# EAGLE design PB32Pico_1.x (EAGLE 9.6.2)
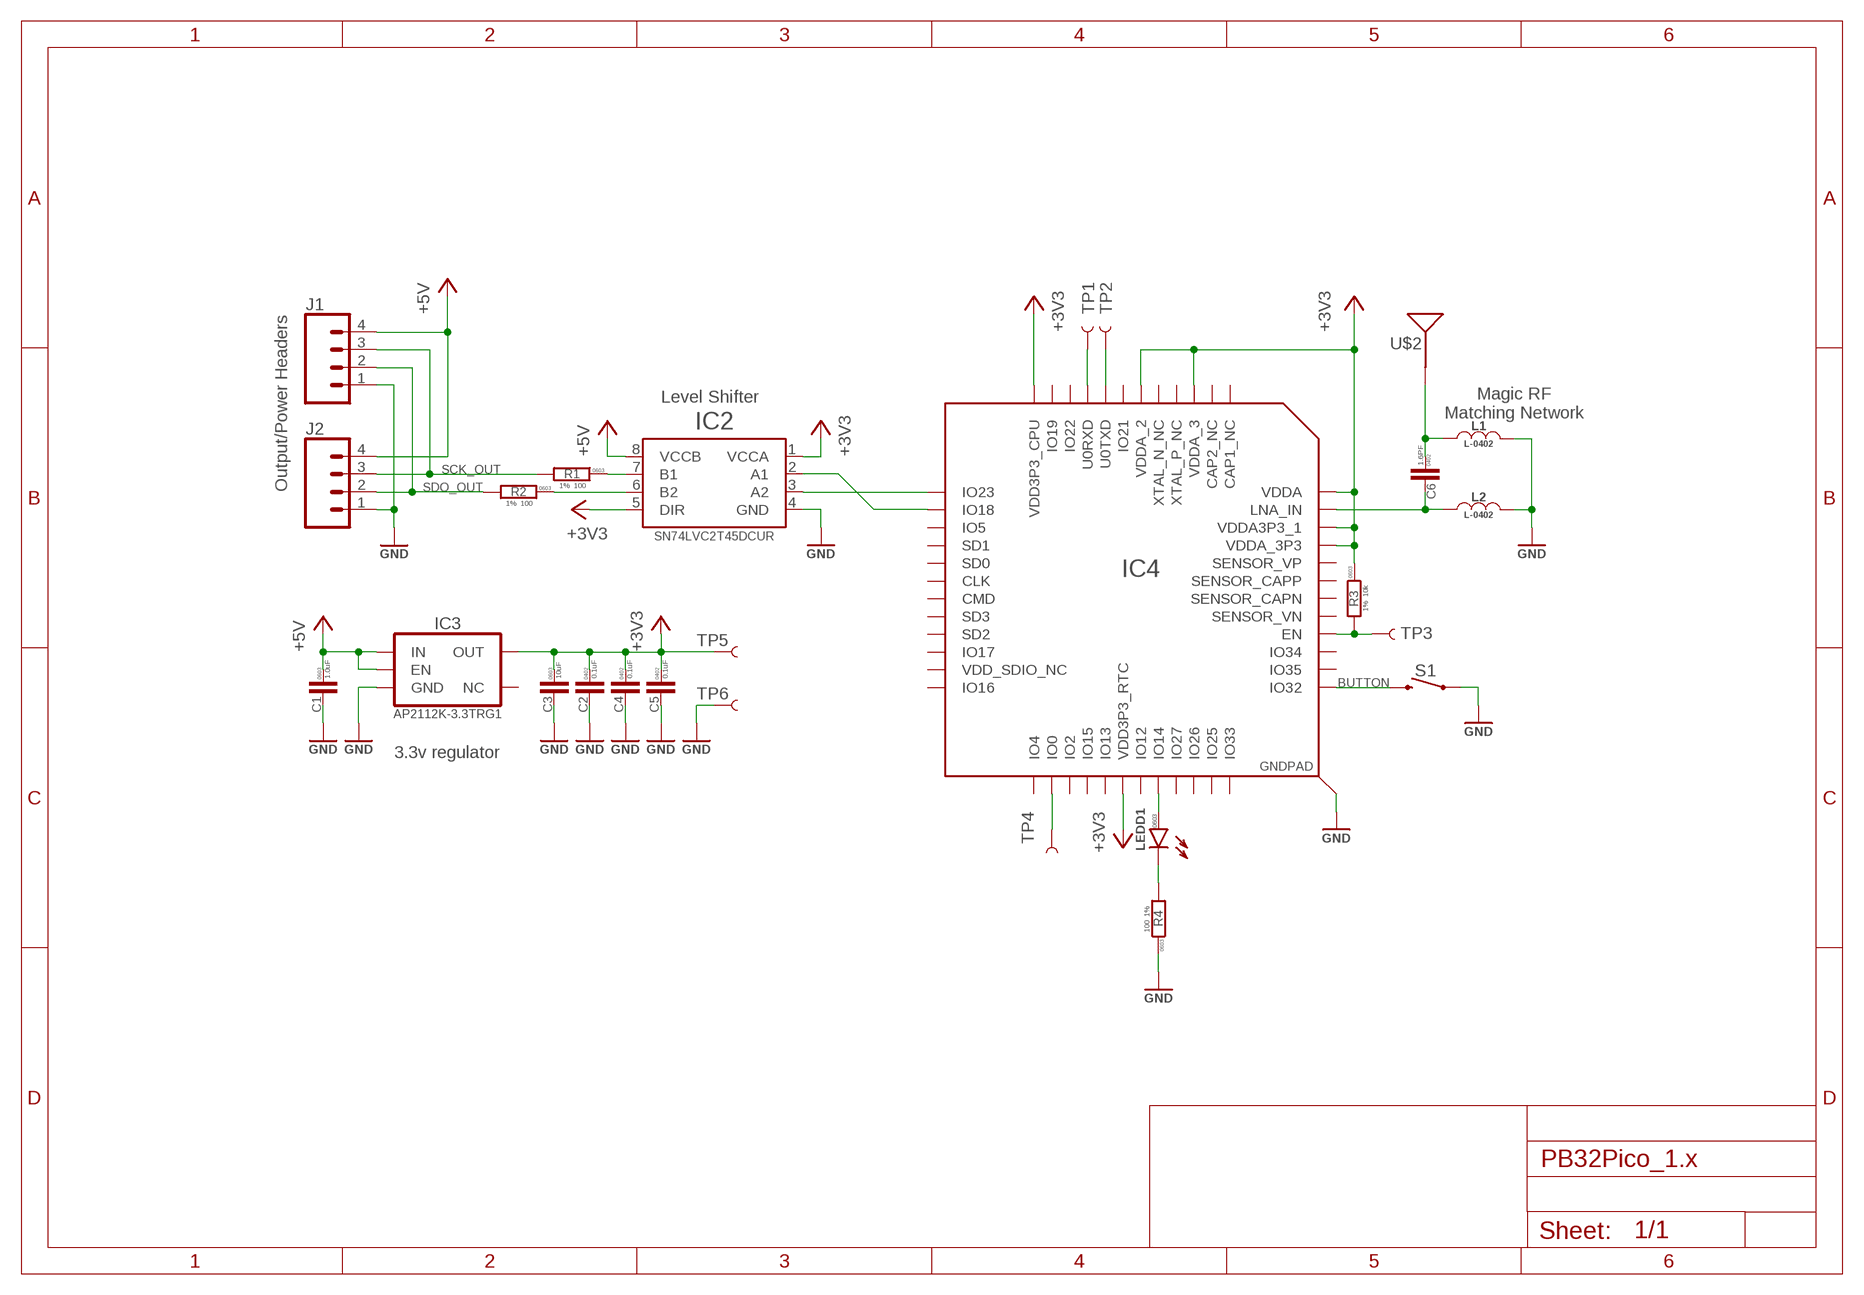
[diagram p0: schematic, sheet 1]

## Parts
C1  1.0uF  C-0603  [C0603]
C2  0.1uF  C-0402  [C0402]
C3  10uF  C-0603  [C0603]
C4  0.1uF  C-0402  [C0402]
C5  0.1uF  C-0402  [C0402]
C6  1.6PF  C-0402  [C0402]
IC2  SN74LVC2T45DCUR  [SOP50P310X90-8N]
IC3  3.3V  V_REG_AP2112K-3.3V  [SOT23-5]
IC4  ESP32-PICO-D4UM-ESP32-PICO-D4  [PICO-D4-QFN48]
J1  CONN_041X04_NO_SILK  [1X04_NO_SILK]
J2  CONN_041X04_NO_SILK  [1X04_NO_SILK]
L1  L-0402  [L0402]
L2  L-0402  [L0402]
LEDD1  LED-0603  [LED0603]
R1  100  R-1%-0603  [R0603]
R2  100  R-1%-0603  [R0603]
R3  10k  R-1%-0603  [R0603]
R4  100  R-1%-0603  [R0603]
S1  MOMENTARY-SWITCH-SPST-SMD-5.2MM  [TACTILE_SWITCH_SMD_5.2MM]
TP1  TEST-POINT3X5  [PAD.03X.05]
TP2  TEST-POINT3X5  [PAD.03X.05]
TP3  TEST-POINT3X5  [PAD.03X.05]
TP4  TEST-POINT3X5  [PAD.03X.05]
TP5  TEST-POINT3X5  [PAD.03X.05]
TP6  TEST-POINT3X5  [PAD.03X.05]
U$2  CHIP-ANTENNASHORT  [CHIPANTENNA-1206-SHORT]

## Nets
+3V3: C2.1 C3.1 C4.1 C5.1 IC2.1(VCCA) IC2.5(DIR) IC3.5(OUT) IC4.1(VDDA) IC4.3(VDDA3P3_1) IC4.4(VDDA_3P3) IC4.19(VDD3P3_RTC) IC4.37(VDD3P3_CPU) IC4.43(VDDA_2) IC4.46(VDDA_3) R3.1 TP5.P$1
+5V: C1.1 IC2.8(VCCB) IC3.1(IN) IC3.3(EN) J1.4 J2.4
BUTTON: IC4.12(IO32) S1.3
EN: IC4.9(EN) R3.2 TP3.P$1
GND: C1.2 C2.2 C3.2 C4.2 C5.2 IC2.4(GND) IC3.2(GND) IC4.EXP(GNDPAD) J1.1 J2.1 L1.2 L2.2 R4.1 S1.1 TP6.P$1
IO0: IC4.23(IO0) TP4.P$1
N$1: C6.1 L1.1 U$2.P$1(SIGNAL)
N$2: IC4.17(IO14) LEDD1.A
N$3: LEDD1.C R4.2
N$4: IC2.7(B1) R1.1
N$5: IC2.6(B2) R2.1
N$6: C6.2 IC4.2(LNA_IN) L2.1
SCK: IC2.2(A1) IC4.35(IO18)
SCK_OUT: J1.3 J2.3 R1.2
SDO: IC2.3(A2) IC4.36(IO23)
SDO_OUT: J1.2 J2.2 R2.2
U0TX: IC4.41(U0TXD) TP2.P$1
UORX: IC4.40(U0RXD) TP1.P$1
Unconnected: IC3.4(NC) IC4.5(SENSOR_VP) IC4.6(SENSOR_CAPP) IC4.8(SENSOR_VN) IC4.10(IO34) IC4.11(IO35) IC4.13(IO33) IC4.14(IO25) IC4.15(IO26) IC4.16(IO27) IC4.20(IO13) IC4.21(IO15) IC4.22(IO2) IC4.24(IO4) IC4.25(IO16) IC4.26(VDD_SDIO_NC) IC4.27(IO17) IC4.28(SD2) IC4.29(SD3) IC4.30(CMD) IC4.31(CLK) IC4.32(SD0) IC4.33(SD1) IC4.34(IO5) IC4.38(IO19) IC4.39(IO22) IC4.44(XTAL_N_NC) IC4.45(XTAL_P_NC) IC4.47(CAP2_NC) IC4.48(CAP1_NC)

## Notes on the sheet
- Level Shifter
- Magic RF
  Matching Network
- Output/Power Headers
- 3.3v regulator

## Power pins joined to a net without a drawn wire
IO12: IC4.18(IO12)
IO21: IC4.42(IO21)
SENSOR_CAPN: IC4.7(SENSOR_CAPN)

## Library data of the parts
C1 C3 = rc:C; PACKAGE: 0603
C2 C4-C6 = rc:C; PACKAGE: 0402
IC2 = pixelblaze:SN74LVC2T45DCUR; MANF#: SN74LVC2T45DCUR
IC3 = pixelblaze:V_REG_AP2112: AP2112 - 600mA CMOS LDO Regulator w/ Enable The AP2112 is CMOS process low dropout linear regulator with enable function, the regulator delivers a guaranteed 600mA (min.) continuous load current. Features Output Voltage Accuracy: ±1.5% Output Current: 600mA (Min.) Foldback Short Current Protection: 50mA Enable Function to Turn ON/OFF VOUT Low Dropout Voltage (3.3V): 250mV (Typ.) @IOUT=600mA Excellent Load Regulation: 0.2%/A (Typ.) Excellent Line Regulation: 0.02%/V (Typ.) Low Quiescent Current: 55μA (Typ.) Low Standby Current: 0.01μA (Typ.) Low Output Noise: 50μVRMS PSRR: 100Hz -65dB, 1kHz -65dB OTSD Protection Stable with 1.0μF Flexible Cap: Ceramic, Tantalum and Aluminum Electrolytic Operation Temperature Range: -40°C to 85°C ESD: MM 400V, HBM 4000V; MANF#: AP2112K-3.3TRG1; PROD_ID: VREG-12457
IC4 = pixelblaze:ESP32-PICO-D4
J1 J2 = SparkFun-Connectors:CONN_04: Multi connection point. Often used as Generic Header-pin footprint for 0.1 inch spaced/style header connections On any of the 0.1 inch spaced packages, you can populate with these: Break Away Headers - Straight <https://www.sparkfun.com/products/116> (PRT-00116) Break Away Male Headers - Right Angle <https://www.sparkfun.com/products/553> (PRT-00553) Female Headers <https://www.sparkfun.com/products/115> (PRT-00115) Break Away Headers - Machine Pin <https://www.sparkfun.com/products/117> (PRT-00117) Break Away Female Headers - Swiss Machine Pin <https://www.sparkfun.com/products/743> (PRT-00743) For SCREWTERMINALS and SPRING TERMINALS visit here: Screw Terimnals on SparkFun.com <https://www.sparkfun.com/search/results?term=Screw+Terminals> (5mm/3.5mm/2.54mm spacing) This device is also useful as a general connection point to wire up your design to another part of your project. Our various solder wires solder well into these plated through hole pads. Hook-Up Wire - Assortment (Stranded, 22 AWG) <https://www.sparkfun.com/products/11375> (PRT-11375) Hook-Up Wire - Assortment (Solid Core, 22 AWG) <https://www.sparkfun.com/products/11367> (PRT-11367) View the entire wire category on our website here <https://www.sparkfun.com/categories/141> Special notes: Molex polarized connector foot print use with SKU : PRT-08231 with associated crimp pins and housings. 1MM SMD Version SKU: PRT-10208; PROD_ID: CONN-09696
L1 L2 = rc:L
LEDD1 = rc:LED: Light emitting diode; PACKAGE: 0603
R1-R4 = rc:R; PACKAGE: 0603; TOLERANCE: 1%
S1 = pixelblaze:MOMENTARY-SWITCH-SPST: Momentary Switch (Pushbutton) - SPST Normally-open (NO) SPST momentary switches (buttons, pushbuttons). Variants PTH-12MM - 12mm square, through-hole Momentary Pushbutton Switch - 12mm Square <https://www.sparkfun.com/products/9190> (COM-09190) PTH-6.0MM, PTH-6.0MM-KIT - 6.0mm square, through-hole Mini Pushbutton Switch <https://www.sparkfun.com/products/97> (COM-00097) KIT package intended for soldering kit's - only one side of pads' copper is exposed. PTH-RIGHT-ANGLE-KIT - Right-angle, through-hole Right Angle Tactile Button <https://www.sparkfun.com/products/10791> - Used on SparkFun BigTime Watch Kit <https://www.sparkfun.com/products/11734> SMD-12MM - 12mm square, surface-mount Tactile Button - SMD (12mm) <https://www.sparkfun.com/products/12993> (COM-12993) Used on SparkFun PicoBoard <https://www.sparkfun.com/products/11888> SMD-4.5MM - 4.5mm Square Trackball Switch Used on SparkFun Blackberry Trackballer Breakout <https://www.sparkfun.com/products/13169> SMD-4.6MMX2.8MM - 4.60mm x 2.80mm, surface mount Used on SparkFun SAMD21 Mini Breakout <https://www.sparkfun.com/products/13664> SMD-5.2MM, SMD-5.2-REDUNDANT - 5.2mm square, surface-mount Mini Pushbutton Switch - SMD <https://www.sparkfun.com/products/8720> (COM-08720) Used on Arduino Pro Mini <https://www.sparkfun.com/products/11114> REDUNDANT package connects both switch circuits together SMD-6.0X3.5MM - 6.0 x 3.5mm, surface mount Momentary Reset Switch SMD <https://www.sparkfun.com/products/8229> (COM-08229) SMD-6.2MM-TALL - 6.2mm square, surface mount Tactile Button - SMD (6mm) <https://www.sparkfun.com/products/12992> Used on SparkFun Digital Sandbox <https://www.sparkfun.com/products/12651> SMD-RIGHT-ANGLE - Right-angle, surface mount Used on SparkFun Block for Intel® Edison - Arduino <https://www.sparkfun.com/products/13036>; PROD_ID: SWCH-08247; SF_SKU: COM-08720
TP1-TP6 = SparkFun-Connectors:TEST-POINT: SparkFun Test Points Bare copper test points for troubleshooting or In-Circuit-Testing. These are used by our Production team for verifying production board runs using pogo-pins on test beds. SparkFun Products: SparkFun LSM9DS1 Breakout <https://www.sparkfun.com/products/13284> SparkFun PSOC <https://www.sparkfun.com/products/13714> SparkFun Load Cell Amplifier <https://www.sparkfun.com/products/13879>
U$2 = pixelblaze:CHIP-ANTENNA

## Board
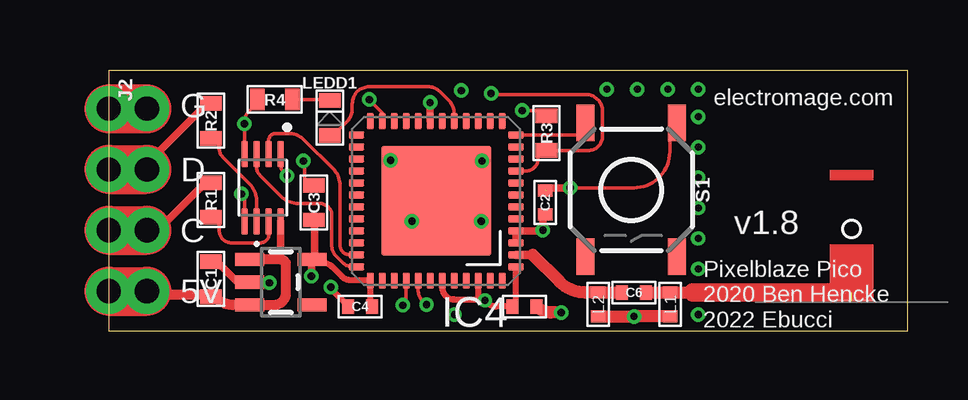
[diagram p1: board, top side]
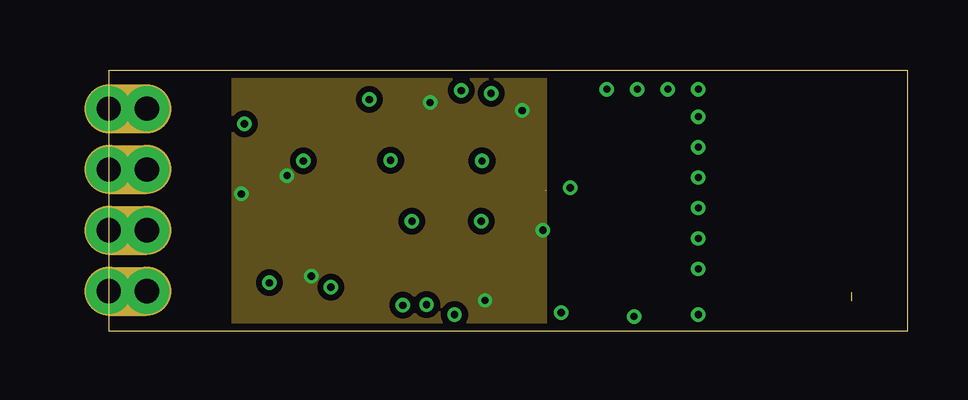
[diagram p2: board, inner layer Route2]
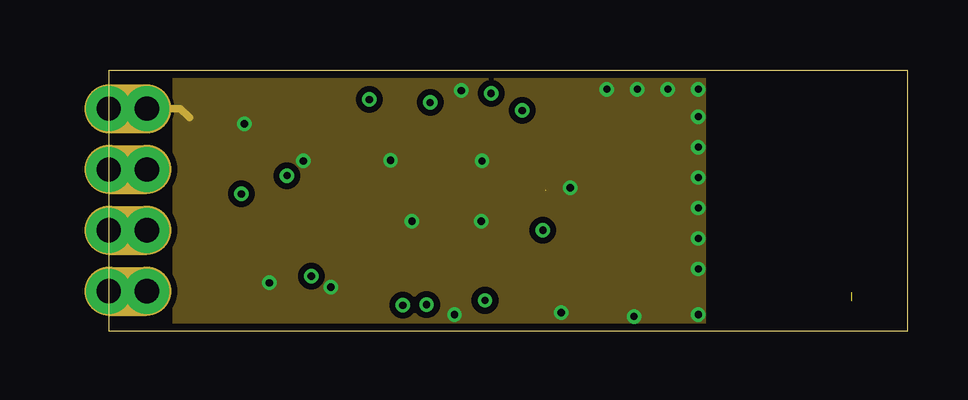
[diagram p3: board, inner layer Route15]
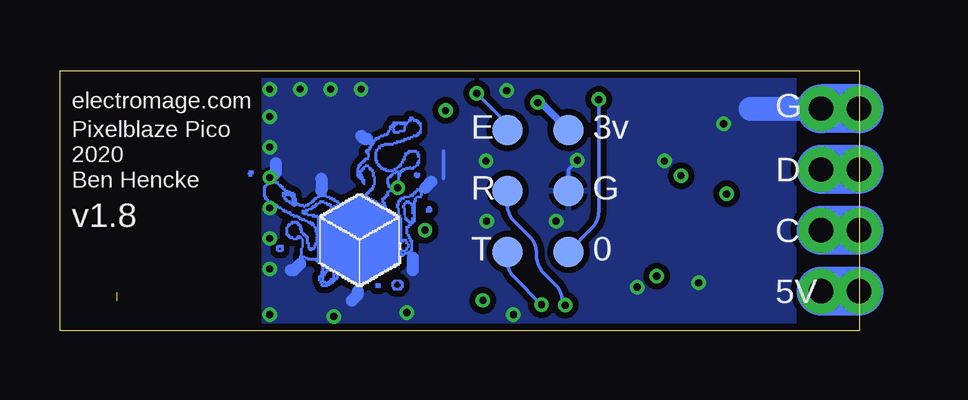
[diagram p4: board, bottom side, seen from below]

Size 33.32 x 10.85 mm. Coordinates in mm from the lower left corner, seen from the top.
Outline: 0,0 33.32,0 33.32,10.85 0,10.85 0,0
Copper layers (1+2*15+16): Top 0.035mm / dielectric 0.12mm / Route2 0.035mm / dielectric 1.2mm / Route15 0.035mm / dielectric 0.12mm / Bottom 0.035mm
Design rules "JLCPCB 4 layer": minimum track width 0.15mm, minimum drill 0.2mm, track to track 0.15mm, track to pad 0.15mm, pad to pad 0.15mm, via to via 0.15mm, smd to smd 0.15mm, copper to edge 0.3mm, drill to drill 0.2mm, minimum pad ring 0.125mm, minimum via ring 0.125mm, stop-mask expansion 1mil, vias tented up to drill 0.31mm, thermal gap 8mil

### Footprints (pad centres in the part's own frame; a part is rotated, then mirrored left to right if it is on the bottom)
C0603 = smd 0.6 x 0.9: 1 -0.725,0; 2 0.725,0
C0402 = smd 0.5 x 0.6: 1 -0.5,0; 2 0.5,0
SOP50P310X90-8N = smd 1.12 x 0.27: 1 -1.405,0.75; 2 -1.405,0.25; 3 -1.405,-0.25; 4 -1.405,-0.75; 5 1.405,-0.75; 6 1.405,-0.25; 7 1.405,0.25; 8 1.405,0.75
SOT23-5 = smd 0.55 x 1.2: 1 -0.95,-1.3; 2 0,-1.3; 3 0.95,-1.3; 4 0.95,1.3; 5 -0.95,1.3
PICO-D4-QFN48 = smd 0.66 x 0.3: 1 -3.327,2.75; 2 -3.327,2.25; 3 -3.327,1.75; 4 -3.327,1.25; 5 -3.327,0.75; 6 -3.327,0.25; 7 -3.327,-0.25; 8 -3.327,-0.75; 9 -3.327,-1.25; 10 -3.327,-1.75; 11 -3.327,-2.25; 12 -3.327,-2.75; 25 3.327,-2.75; 26 3.327,-2.25; 27 3.327,-1.75; 28 3.327,-1.25; 29 3.327,-0.75; 30 3.327,-0.25; 31 3.327,0.25; 32 3.327,0.75; 33 3.327,1.25; 34 3.327,1.75; 35 3.327,2.25; 36 3.327,2.75 | smd 0.3 x 0.66: 13 -2.75,-3.327; 14 -2.25,-3.327; 15 -1.75,-3.327; 16 -1.25,-3.327; 17 -0.75,-3.327; 18 -0.25,-3.327; 19 0.25,-3.327; 20 0.75,-3.327; 21 1.25,-3.327; 22 1.75,-3.327; 23 2.25,-3.327; 24 2.75,-3.327; 37 2.75,3.327; 38 2.25,3.327; 39 1.75,3.327; 40 1.25,3.327; 41 0.75,3.327; 42 0.25,3.327; 43 -0.25,3.327; 44 -0.75,3.327; 45 -1.25,3.327; 46 -1.75,3.327; 47 -2.25,3.327; 48 -2.75,3.327 | smd 4.572 x 4.572: EXP 0,0
1X04_NO_SILK = drill 1.016 pad 1.88: 1 0,0; 2 2.54,0; 3 5.08,0; 4 7.62,0
L0402 = smd 0.5 x 0.6: 1 -0.5,0; 2 0.5,0
LED0603 = smd 0.6 x 0.9: A 0.725,0; C -0.725,0
R0603 = smd 0.6 x 0.9: 1 -0.725,0; 2 0.725,0
TACTILE_SWITCH_SMD_5.2MM = smd 1.524 x 0.762: 1 -2.794,1.905; 2 2.794,1.905; 3 -2.794,-1.905; 4 2.794,-1.905
PAD.03X.05 = smd 1.27 x 1.27: P$1 0,0
CHIPANTENNA-1206-SHORT = smd 0.1 x 1.8: P$1 -3.7,0

### Placement (x,y rotation side)
C1  4.26,2.16 90 top
C2  18.2,5.35 90 top
C3  8.55,5.35 90 top
C4  10.48,1.02 180 top
C5  17.34,1.02 0 top
C6  21.9,1.6 180 top
IC2  6.42,5.97 270 top
IC3  7.18,2.03 270 top
IC4  13.65,5.42 180 top
J1  1.59,9.27 270 top
J2  0,9.27 270 top
L1  23.4,1.1 270 top
L2  20.4,1.1 270 top
LEDD1  9.21,8.89 270 top
R1  4.26,5.46 90 top
R2  4.26,8.76 90 top
R3  18.25,8.25 270 top
R4  6.92,9.65 0 top
S1  21.78,5.88 270 top
TP1  14.67,5.84 0 bottom
TP2  14.67,3.3 0 bottom
TP3  14.67,8.38 0 bottom
TP4  12.13,3.3 0 bottom
TP5  12.13,8.38 0 bottom
TP6  12.13,5.84 0 bottom
U$2  30.96,4.95 90 top
U$3  [ELECTRO_MAGE_PCB4_PIXEL_2#PNG]  21.66,5.33 0 bottom

### Tracks (layer width: path | path; a pad name or v marks a point on that pad's centre or on a via)
+3V3  (via drill 0.3 pad 0.6)
  Top 0.152: IC2.5 5.67,5.38 arc45 v5.53,5.71 | IC2.1 7.17,6.95 arc45 7.31,6.6 v7.43,6.48 | R3.1 18.03,9.19 v17.24,9.19
  Top 0.25: IC4.43 13.9,1.81 arc90 14.4,1.31 15.4,1.31 | 15.4,1.31 15.64,1.31 v15.69,1.27 15.79,1.16 arc45 16.15,1.02 C5.1 | IC4.46 15.4,1.32 15.4,1.31
  Top 0.254: C4.1 10.9,1.17 IC4.37 10.88,2.12 10.07,2.12 arc-45 9.72,2.27 9.3,2.69 arc45 8.95,2.83 8.63,2.83 IC3.5 | 16.76,1.16 16.84,1.09 C5.1 16.95,1.02 16.95,2.64 IC4.1
  Top 0.305: C3.1 8.58,4.6 8.58,2.98 IC3.5 8.45,2.95 v8.45,2.29 | IC4.3 IC4.4 18.1,4.17 v18.1,4.2 18.1,4.75 C2.1 | IC4.19 v13.4,9.52 v13.4,9.53
  Bottom 0.305: TP5.P$1 13.27,9.53 v13.4,9.53
  pour Route2 (isolate 0.254): 5.2,10.79 18.2,10.79 18.2,0 5.2,0
+5V
  Top 0.305: IC2.8 7.17,2.98
  Top 0.406: J1.4 1.74,1.5 4.19,1.5 C1.1 4.41,1.43 4.47,1.38 arc45 5.17,1.08 IC3.3 6.89,1.08 arc90 7.39,1.58 7.39,2.76 arc90 7.17,2.98 IC3.1
  Top 2.032: J2.4 J1.4
  Route2 2.032: J2.4 J1.4
  Route15 2.032: J2.4 J1.4
  Bottom 2.032: J2.4 J1.4
BUTTON
  Top 0.152: IC4.12 19.88,8.17 S1.3
EN  (via drill 0.3 pad 0.6)
  Top 0.152: IC4.9 17.4,6.67 arc90 17.9,7.17 17.9,7.53 R3.2 19.99,7.53 arc90 20.59,8.12 20.59,9.16 arc90 19.89,9.86 15.99,9.86 v15.94,9.91
  Bottom 0.152: v15.94,9.91 14.67,8.64 TP3.P$1
GND  (via drill 0.3 pad 0.6)  (1 unrouted)
  Top 0.15: 8.17,7.04 8.17,6.08
  Top 0.152: C3.2 8.17,6.08 | 8.17,7.04 v8.12,7.09 | IC2.4 5.67,8.62 v5.65,8.64 5.65,8.75 arc-45 5.8,9.1 6.2,9.5 R4.1 | S1.1 23.39,8.37 23.39,7.47 arc-90 21.89,5.97 v19.24,5.97
  Top 0.254: C4.2 9.98,1.04 9.26,1.76 v9.26,1.83
  Top 0.305: C1.2 4.53,2.88 5.38,2.03 IC3.2 5.9,2.01 v6.7,2.01 | v19.24,5.97 19.22,5.95 18.22,5.95 18.22,5.85 | 11.97,7.11 v11.75,7.11
  Top 0.5: L2.2 v21.9,0.6 L1.2
  Top 0.508: v18.86,0.76 18.45,0.76 arc-45 C5.2 | IC4.EXP 12.8,4.57 v12.64,4.57
  Top 2.032: J2.1 J1.1
  Route2 2.032: J2.1 J1.1
  Route15 0.305: J1.1 2.99,9.27 3.37,8.89
  Route15 2.032: J2.1 J1.1
  Bottom 0.152: v11.75,7.11 12.13,6.73 TP6.P$1 | 17.34,7.49 17.34,6.35
  Bottom 0.508: 24.32,6.99 24.32,6.6 24.45,6.48 | 22.42,6.35 22.42,5.84 | 23.69,2.54 23.56,2.54 23.31,2.79 | 21.15,1.27 20.89,1.52 20.89,1.65 | 18.61,2.54 18.61,3.05 | 17.85,6.22 18.1,5.97 | 20.77,8.13 20.64,8 20.51,8
  Bottom 1: 4.52,9.27 J1.1
  Bottom 2.032: J2.1 J1.1
  other vias: 15.56,7.09 15.53,4.57 24.58,0.68 24.58,2.59 24.58,3.86 24.58,5.13 24.58,6.4 24.58,7.67 24.58,8.94 24.58,10.08 23.31,10.08 22.04,10.08 20.77,10.08 14.7,10.03 14.42,0.68
  pour Route15 (isolate 0.254): 2.73,10.79 24.83,10.79 24.83,0 2.73,0
  pour Bottom (isolate 0.254): 2.68,0 24.83,0 24.83,10.79 2.68,10.79
IO0  (via drill 0.3 pad 0.6)
  Top 0.152: v10.86,9.65 11.4,9.11 IC4.23
  Bottom 0.152: TP4.P$1 11.15,4.28 arc-45 10.86,4.99 v10.86,9.65
N$1  (1 unrouted)
  Top 0.5: C6.1 L1.1 24.35,1.6
  Top 0.762: 24.35,1.6 30.96,1.6
N$2
  Top 0.152: IC4.17 14.4,9.09 arc45 14.2,9.58 13.8,9.98 arc45 13.31,10.18 10.86,10.18 arc90 10.15,9.48 10.15,9.25 arc-45 9.95,8.76 9.36,8.16 LEDD1.A
N$3
  Top 0.152: R4.2 9.1,9.65 LEDD1.C
N$4
  Top 0.152: IC2.7 6.68,4.02 arc-90 6.33,3.67 5.11,3.67 arc-90 4.61,4.17 4.61,4.74 R1.1
N$5
  Top 0.152: IC2.6 6.16,5.43 arc45 5.87,6.13 4.75,7.25 arc-45 4.61,7.6 4.61,8.04 R2.1
N$6
  Top 0.35: 17.67,3.17 IC4.2
  Top 0.5: C6.2 L2.1 19.86,1.6 arc-45 18.8,2.04 17.67,3.17
SCK
  Top 0.152: IC2.2 6.67,7.94 arc-90 6.97,8.24 7.47,8.24 arc-45 8.17,7.95 9.36,6.76 arc-45 9.65,6.06 9.65,3.57 arc90 10.05,3.17 IC4.35
SCK_OUT
  Top 0.305: R1.2 4.11,6.04 3.88,6.04 2.04,4.19 J1.3
  Top 2.032: J2.3 J1.3
  Route2 2.032: J2.3 J1.3
  Route15 2.032: J2.3 J1.3
  Bottom 2.032: J2.3 J1.3
SDO
  Top 0.152: IC2.3 6.17,6.84 arc45 6.31,6.49 7.19,5.61 arc45 7.9,5.31 8.8,5.31 arc-90 9.3,4.81 9.3,3.52 arc45 9.45,3.17 9.79,2.82 arc45 10.15,2.67 IC4.36
SDO_OUT
  Top 0.305: R2.2 4.11,9.49 1.47,6.85 J1.2
  Top 2.032: J2.2 J1.2
  Route2 2.032: J2.2 J1.2
  Route15 2.032: J2.2 J1.2
  Bottom 2.032: J2.2 J1.2
U0TX  (via drill 0.3 pad 0.6)
  Top 0.152: IC4.41 12.9,1.64 arc45 13.05,1.29 v13.25,1.09
  Bottom 0.152: TP2.P$1 14.67,2.93 arc-45 14.38,2.22 v13.25,1.09
UORX  (via drill 0.3 pad 0.6)
  Top 0.152: v12.26,1.07 v12.26,1.07 arc45 12.4,1.42 IC4.40
  Bottom 0.152: TP1.P$1 14.67,5.27 arc-45 14.38,4.56 13.74,3.93 arc45 13.45,3.22 13.45,3.13 arc-45 13.16,2.42 12.68,1.94 arc45 12.38,1.24 12.38,1.19 v12.26,1.07

### Text on the board
tPlace: G | electromage.com | D | C | v1.8 | 5V | Pixelblaze Pico / 2020 Ben Hencke / 2022 Ebucci
bPlace: G | electromage.com | 3v | E | D | Pixelblaze Pico / 2020 / Ben Hencke | G | R | C | v1.8 | 0 | T | 5V